# EAGLE schematic io-test-8255 (EAGLE 9.6.2)
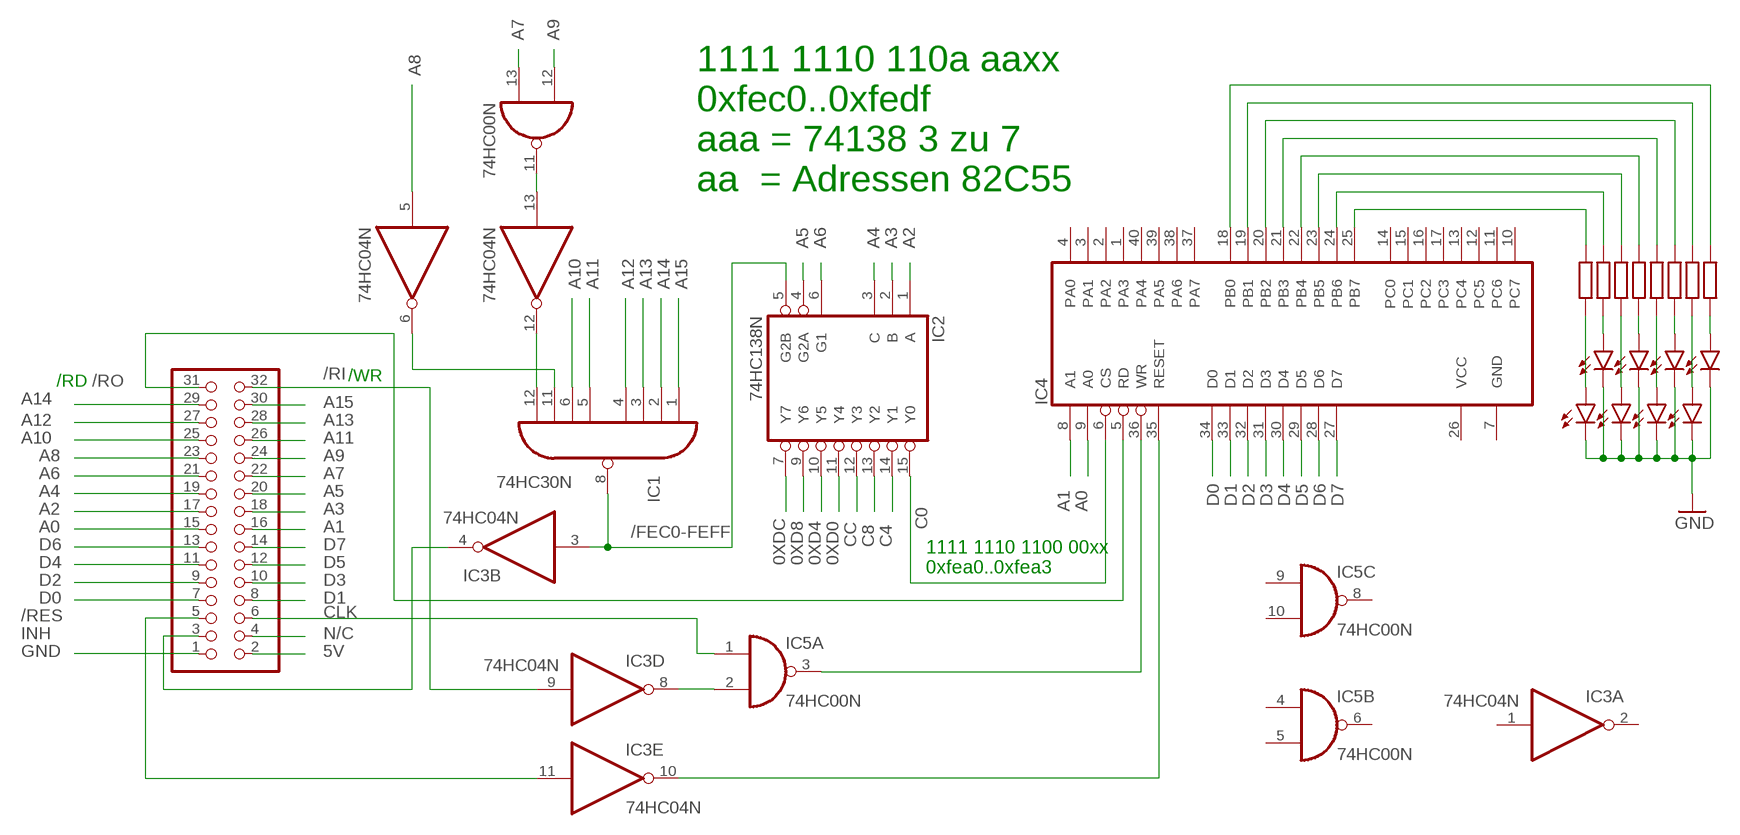
[diagram p0: schematic, sheet 1]

## Parts
IC1  74HC30N  [DIL14]
IC2  74HC138N  [DIL16]
IC3  74HC04N  [DIL14]
IC4  82C55A  [DIL40]
IC5  74HC00N  [DIL14]
JP1  PINHD-2X16  [2X16]
LED1  LED  [SMARTLED-TTW]
LED2  LED  [SMARTLED-TTW]
LED3  LED  [SMARTLED-TTW]
LED4  LED  [SMARTLED-TTW]
LED5  LED  [SMARTLED-TTW]
LED6  LED  [SMARTLED-TTW]
LED7  LED  [SMARTLED-TTW]
LED8  LED  [SMARTLED-TTW]
R1  R-EU_R0603  [R0603]
R2  R-EU_R0603  [R0603]
R3  R-EU_R0603  [R0603]
R4  R-EU_R0603  [R0603]
R5  R-EU_R0603  [R0603]
R6  R-EU_R0603  [R0603]
R7  R-EU_R0603  [R0603]
R8  R-EU_R0603  [R0603]

## Nets
0XD0: IC2.11(Y4)
0XD4: IC2.10(Y5)
0XD8: IC2.9(Y6)
0XDC: IC2.7(Y7)
5V: JP1.2
/FEC0-FEFF: IC1.8(O) IC2.5(G2B) IC3.3(B:I)
/RES: IC3.11(E:I) JP1.5
/RI: IC3.9(D:I) JP1.32
/RO: IC4.5(RD) JP1.31
A0: IC4.9(A0) JP1.15
A1: IC4.8(A1) JP1.16
A2: IC2.1(A) JP1.17
A3: IC2.2(B) JP1.18
A4: IC2.3(C) JP1.19
A5: IC2.4(G2A) JP1.20
A6: IC2.6(G1) JP1.21
A7: IC5.13(D:I1) JP1.22
A8: IC3.5(C:I) JP1.23
A9: IC5.12(D:I0) JP1.24
A10: IC1.6(I5) JP1.25
A11: IC1.5(I4) JP1.26
A12: IC1.4(I3) JP1.27
A13: IC1.3(I2) JP1.28
A14: IC1.2(I1) JP1.29
A15: IC1.1(I0) JP1.30
C0: IC2.15(Y0) IC4.6(CS)
C4: IC2.14(Y1)
C8: IC2.13(Y2)
CC: IC2.12(Y3)
CLK: IC5.1(A:I0) JP1.6
D0: IC4.34(D0) JP1.7
D1: IC4.33(D1) JP1.8
D2: IC4.32(D2) JP1.9
D3: IC4.31(D3) JP1.10
D4: IC4.30(D4) JP1.11
D5: IC4.29(D5) JP1.12
D6: IC4.28(D6) JP1.13
D7: IC4.27(D7) JP1.14
GND: JP1.1 LED1.C@1(C) LED2.C@1(C) LED3.C@1(C) LED4.C@1(C) LED5.C@1(C) LED6.C@1(C) LED7.C@1(C) LED8.C@1(C)
INH: IC3.4(B:O) JP1.3
N$1: LED1.A@1(A) R1.1
N$2: LED2.A@1(A) R2.1
N$3: LED3.A@1(A) R3.1
N$4: LED4.A@1(A) R4.1
N$5: LED5.A@1(A) R5.1
N$6: LED6.A@1(A) R6.1
N$7: LED7.A@1(A) R7.1
N$8: LED8.A@1(A) R8.1
N$9: IC3.10(E:O) IC4.35(RESET)
N$10: IC4.25(PB7) R1.2
N$11: IC4.24(PB6) R2.2
N$12: IC4.23(PB5) R3.2
N$13: IC4.22(PB4) R4.2
N$14: IC4.21(PB3) R5.2
N$15: IC4.20(PB2) R6.2
N$16: IC4.19(PB1) R7.2
N$17: IC4.18(PB0) R8.2
N$19: IC1.11(I6) IC3.6(C:O)
N$20: IC3.8(D:O) IC5.2(A:I1)
N$21: IC4.36(WR) IC5.3(A:O)
N$26: IC3.13(F:I) IC5.11(D:O)
N$27: IC1.12(I7) IC3.12(F:O)
N/C: JP1.4
Unconnected: IC3.1(A:I) IC3.2(A:O) IC4.1(PA3) IC4.2(PA2) IC4.3(PA1) IC4.4(PA0) IC4.10(PC7) IC4.11(PC6) IC4.12(PC5) IC4.13(PC4) IC4.14(PC0) IC4.15(PC1) IC4.16(PC2) IC4.17(PC3) IC4.37(PA7) IC4.38(PA6) IC4.39(PA5) IC4.40(PA4) IC5.4(B:I0) IC5.5(B:I1) IC5.6(B:O) IC5.8(C:O) IC5.9(C:I0) IC5.10(C:I1)

## Notes on the sheet
- 1111 1110 110a aaxx
  0xfec0..0xfedf
  aaa = 74138 3 zu 7
  aa  = Adressen 82C55
- /WR
- /RD
- 1111 1110 1100 00xx
  0xfea0..0xfea3

## Power pins joined to a net without a drawn wire
GND: IC1.7(GND) IC2.8(GND) IC3.7(P:GND) IC4.7(GND) IC5.7(P:GND)
VCC: IC1.14(VCC) IC2.16(VCC) IC3.14(P:VCC) IC4.26(VCC) IC5.14(P:VCC)

## Library data of the parts
IC1 = 74xx-eu:74*30: 8-input NAND gate
IC2 = 74xx-eu:74*138: 3-line to 8-line DECODER/DEMULTIPLEXER
IC3 = 74xx-eu:74*04: Hex INVERTER
IC4 = micro-intel:82C55A: MICROCOMPUTER/PERIPHERAL DEVICE; MF: INTERSIL; MPN: IP82C55AZ; OC_FARNELL: 1562050; OC_NEWARK: 79K6939
IC5 = 74xx-eu:74*00: Quad 2-input NAND gate
JP1 = pinhead:PINHD-2X16: PIN HEADER
LED1-LED8 = led:LED: LED OSRAM: - CHIPLED LG R971, LG N971, LY N971, LG Q971, LY Q971, LO R971, LY R971 LH N974, LH R974 LS Q976, LO Q976, LY Q976 LO Q996 - Hyper CHIPLED LW Q18S LB Q993, LB Q99A, LB R99A - SideLED LS A670, LO A670, LY A670, LG A670, LP A670 LB A673, LV A673, LT A673, LW A673 LH A674 LY A675 LS A676, LA A676, LO A676, LY A676, LW A676 LS A679, LY A679, LG A679 - Hyper Micro SIDELED® LS Y876, LA Y876, LO Y876, LY Y876 LT Y87S - SmartLED LW L88C, LW L88S LB L89C, LB L89S, LG L890 LS L89K, LO L89K, LY L89K LS L896, LA L896, LO L896, LY L896 - TOPLED LS T670, LO T670, LY T670, LG T670, LP T670 LSG T670, LSP T670, LSY T670, LOP T670, LYG T670 LG T671, LOG T671, LSG T671 LB T673, LV T673, LT T673, LW T673 LH T674 LS T676, LA T676, LO T676, LY T676, LB T676, LH T676, LSB T676, LW T676 LB T67C, LV T67C, LT T67C, LS T67K, LO T67K, LY T67K, LW E67C LS E67B, LA E67B, LO E67B, LY E67B, LB E67C, LV E67C, LT E67C LW T67C LS T679, LY T679, LG T679 LS T770, LO T770, LY T770, LG T770, LP T770 LB T773, LV T773, LT T773, LW T773 LH T774 LS E675, LA E675, LY E675, LS T675 LS T776, LA T776, LO T776, LY T776, LB T776 LHGB T686 LT T68C, LB T68C - Hyper Mini TOPLED® LB M676 - Mini TOPLED Santana® LG M470 LS M47K, LO M47K, LY M47K Source: http://www.osram.convergy.de LUXEON: - LUMILED® LXK2-PW12-R00, LXK2-PW12-S00, LXK2-PW14-U00, LXK2-PW14-V00 LXK2-PM12-R00, LXK2-PM12-S00, LXK2-PM14-U00 LXK2-PE12-Q00, LXK2-PE12-R00, LXK2-PE12-S00, LXK2-PE14-T00, LXK2-PE14-U00 LXK2-PB12-K00, LXK2-PB12-L00, LXK2-PB12-M00, LXK2-PB14-N00, LXK2-PB14-P00, LXK2-PB14-Q00 LXK2-PR12-L00, LXK2-PR12-M00, LXK2-PR14-Q00, LXK2-PR14-R00 LXK2-PD12-Q00, LXK2-PD12-R00, LXK2-PD12-S00 LXK2-PH12-R00, LXK2-PH12-S00 LXK2-PL12-P00, LXK2-PL12-Q00, LXK2-PL12-R00 Source: www.luxeon.com KINGBRIGHT: KA-3528ASYC Source: www.kingbright.com
R1-R8 = rcl:R-EU_: RESISTOR, European symbol; SPICEPREFIX: R